# EasyEDA schematic SCH_Garage-door-control_2022-09-19.json
TITLE: Garage-door-control; REV: 1.0.0; Date: 2022-09-14; Sheet: 1/1; Drawn By: Excodibur
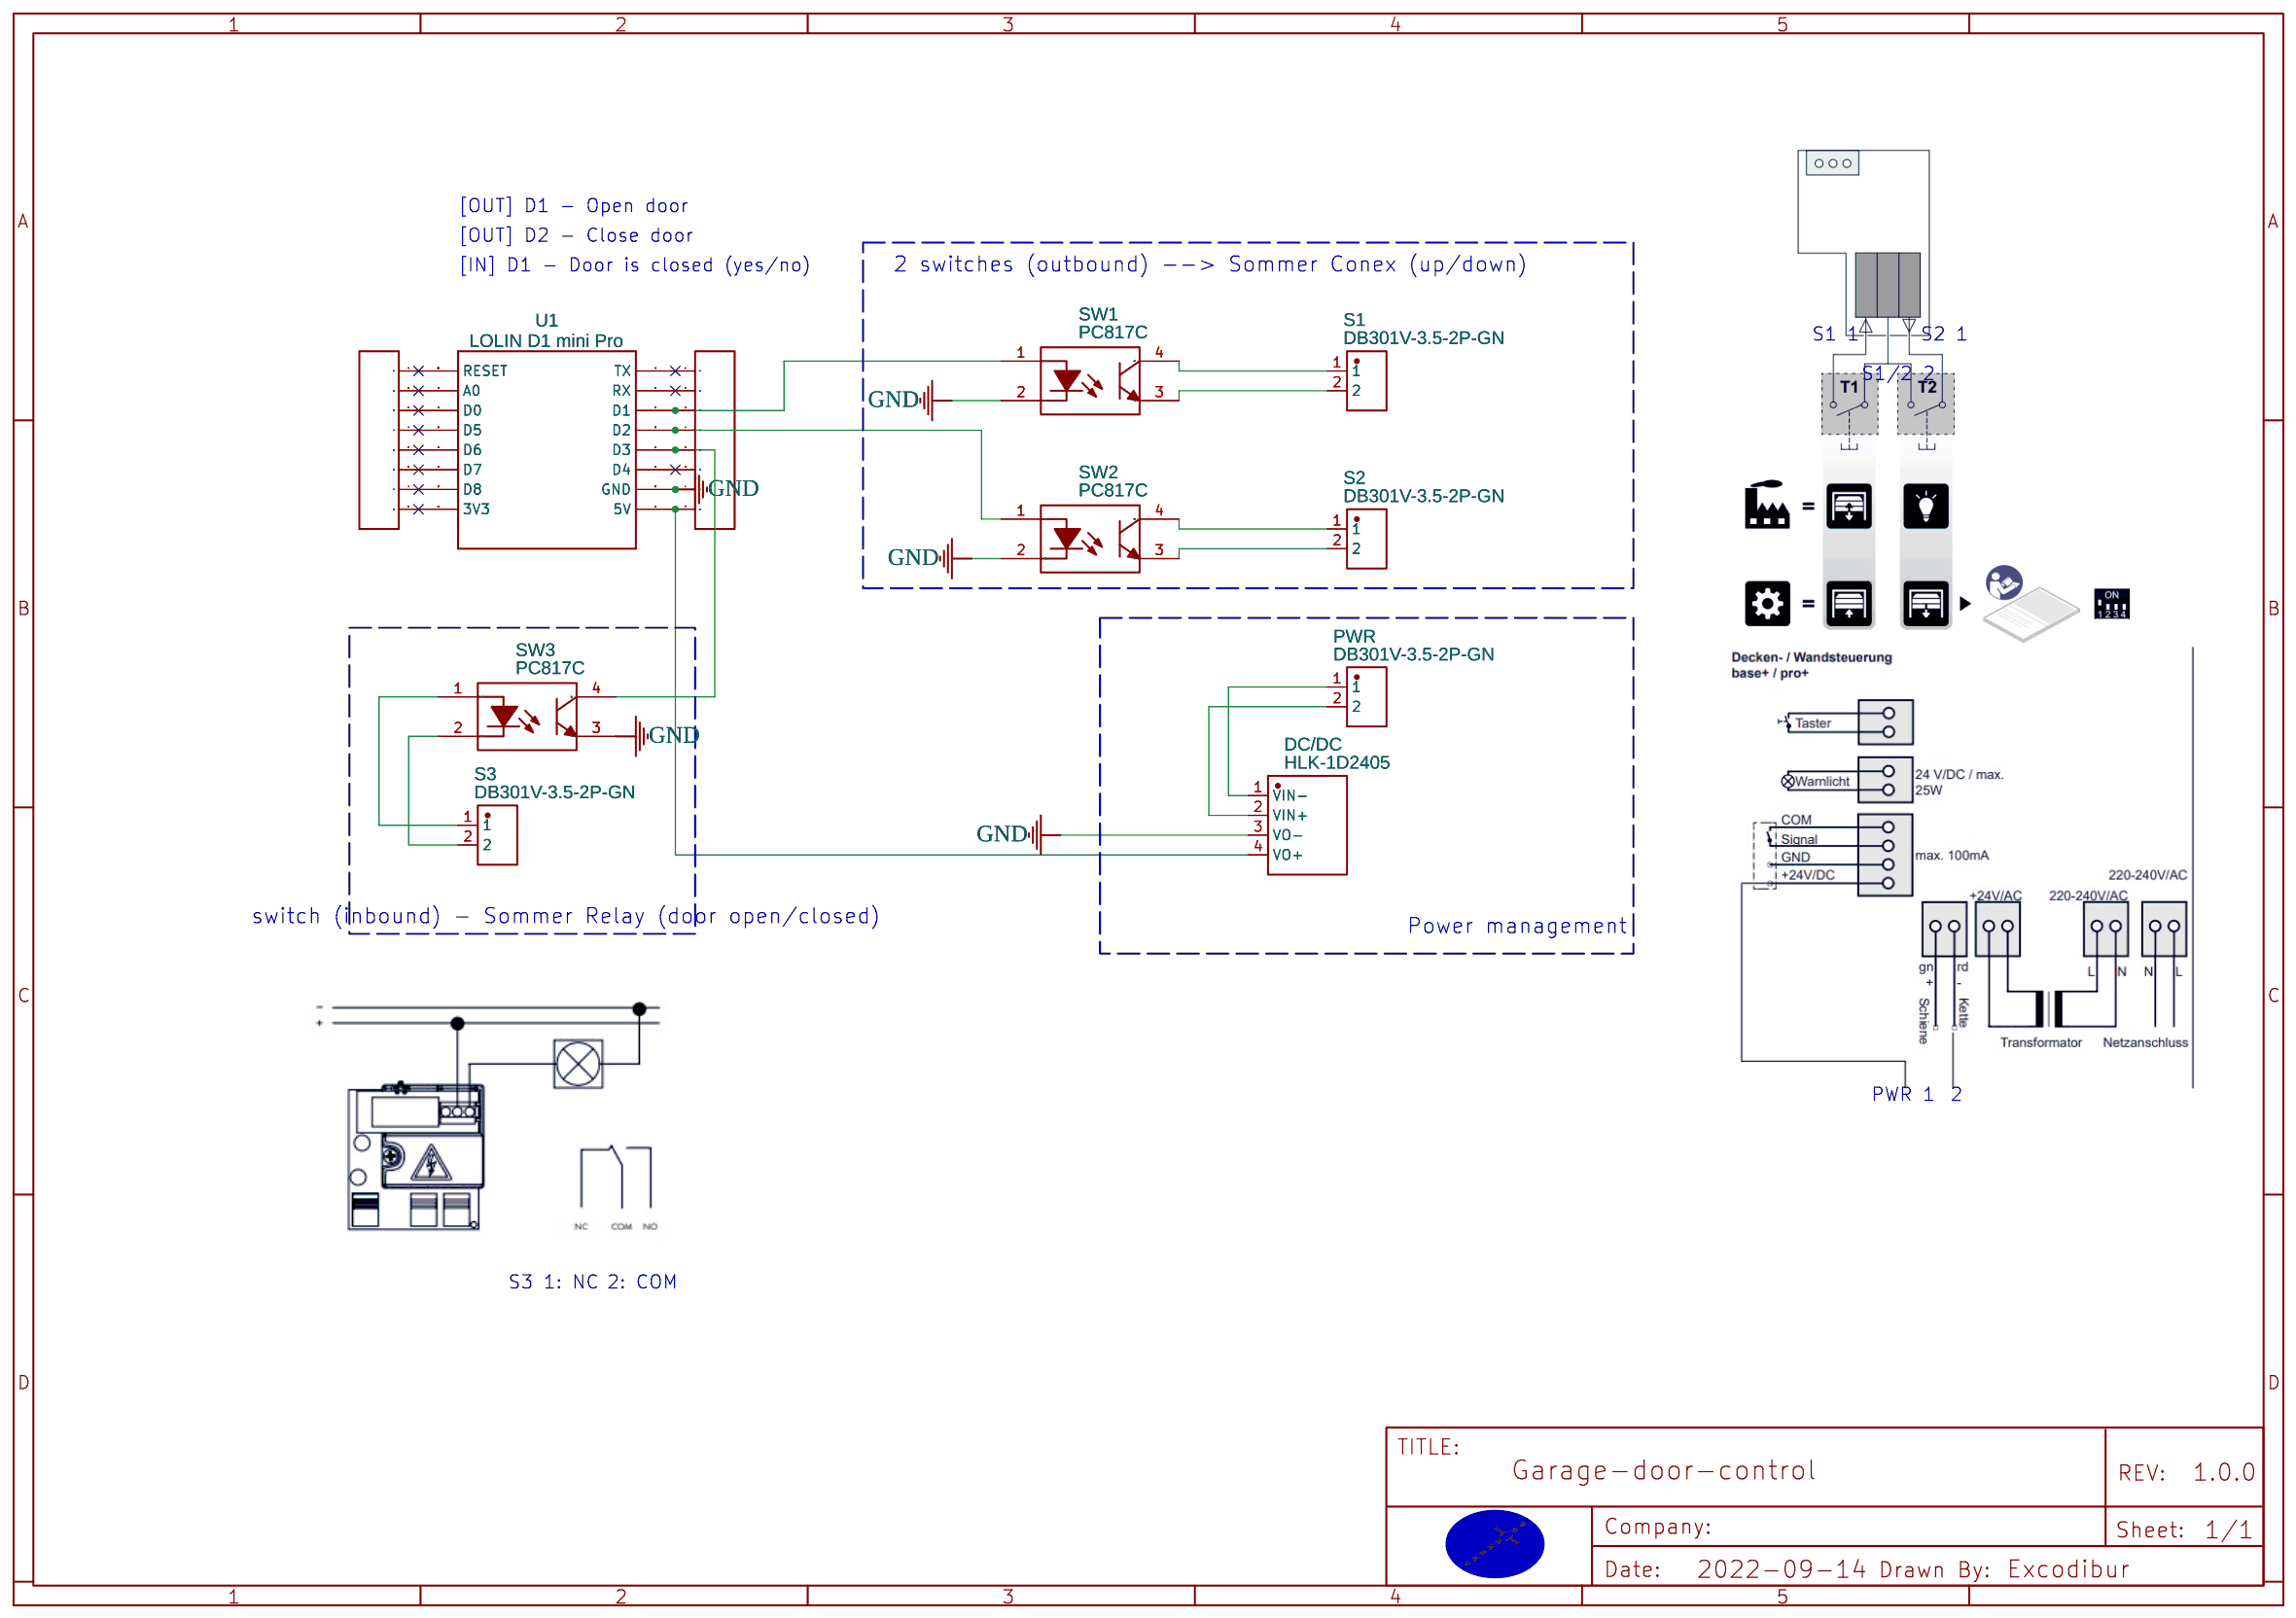
[diagram p0: schematic sheet]

## Parts
DC/DC  HLK-1D2405  [PWRM-TH_HLK-1DXXXX]
P1  Header-Female-2.54_1x8  [HDR-TH_8P-P2.54-V-F-1]
P2  Header-Female-2.54_1x8  [HDR-TH_8P-P2.54-V-F-1]
PWR  DB301V-3.5-2P-GN  [CONN-TH_DB301V-3.5-2P-GN]
S1  DB301V-3.5-2P-GN  [CONN-TH_DB301V-3.5-2P-GN]
S2  DB301V-3.5-2P-GN  [CONN-TH_DB301V-3.5-2P-GN]
S3  DB301V-3.5-2P-GN  [CONN-TH_DB301V-3.5-2P-GN]
SW1  PC817C  [DIP-4_L4.6-W6.5-P2.54-LS7.6-BL]
SW2  PC817C  [DIP-4_L4.6-W6.5-P2.54-LS7.6-BL]
SW3  PC817C  [DIP-4_L4.6-W6.5-P2.54-LS7.6-BL]
U1  LOLIN D1 mini Pro  [LOLIN D1 MINI PRO]

## Library data of the parts
DC/DC = HLK-1D2405: Supplier: LCSC; Supplier Part: C474032; Manufacturer: HI-LINK; Contributor: LCSC; JLCPCB Part Class: Extended Part
P1 P2 = Header-Female-2.54_1x8: Supplier: LCSC; Manufacturer: BOOMELE; Manufacturer Part: Female headerHDR1X8-2.54; Supplier Part: C27438; JLCPCB Part Class: Extended Part
PWR S1-S3 = DB301V-3.5-2P-GN: Supplier: LCSC; Supplier Part: C695629; Manufacturer: DIBO; Contributor: LCSC; JLCPCB Part Class: Extended Part
SW1-SW3 = PC817C: Supplier: LCSC; Supplier Part: C115500; Manufacturer: Wuxi China Resources Huajing Microelectronics; Contributor: LCSC; JLCPCB Part Class: Extended Part
U1 = LOLIN D1 mini Pro: WeMos.cc; Contributor: Folders; Supplier: AliExpress; Supplier Part: D1_mini_Pro; Manufacturer: LOLIN; link: https://www.aliexpress.com/item/32724692514.html

## Nets
GND: DC/DC.3(VO-) P2.7 SW1.2(CAT) SW2.2(CAT) SW3.3(EM) U1.GND
Net-(DC/DC-1): DC/DC.1(VIN-) PWR.1
Net-(DC/DC-2): DC/DC.2(VIN+) PWR.2
Net-(DC/DC-4): DC/DC.4(VO+) P2.8 U1.5V
Net-(P1-1): P1.1 U1.RESET
Net-(P1-2): P1.2 U1.A0
Net-(P1-3): P1.3 U1.D0
Net-(P1-4): P1.4 U1.D5
Net-(P1-5): P1.5 U1.D6
Net-(P1-6): P1.6 U1.D7
Net-(P1-7): P1.7 U1.D8
Net-(P1-8): P1.8 U1.3V3
Net-(P2-1): P2.1 U1.TX
Net-(P2-2): P2.2 U1.RX
Net-(P2-3): P2.3 SW1.1(AN) U1.D1
Net-(P2-4): P2.4 SW2.1(AN) U1.D2
Net-(P2-5): P2.5 SW3.4(COL) U1.D3
Net-(P2-6): P2.6 U1.D4
Net-(S1-1): S1.1 SW1.4(COL)
Net-(S1-2): S1.2 SW1.3(EM)
Net-(S2-1): S2.1 SW2.4(COL)
Net-(S2-2): S2.2 SW2.3(EM)
Net-(S3-1): S3.1 SW3.1(AN)
Net-(S3-2): S3.2 SW3.2(CAT)

## Notes on the sheet
- [OUT] D1 - Open door
- [OUT] D2 - Close door
- [IN] D1 - Door is closed (yes/no)
- 2 switches (outbound) --> Sommer Conex (up/down)
- S1 1
- S2 1
- S1/2 2
- switch (inbound) - Sommer Relay (door open/closed)
- Power management
- PWR 1
- 2
- S3 1: NC
- 2: COM
